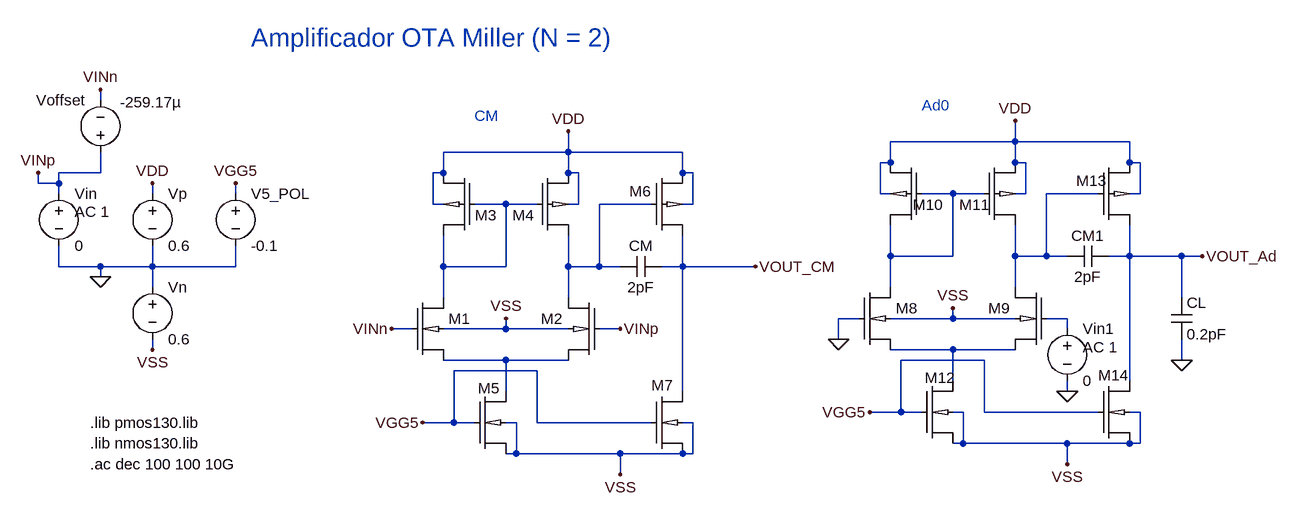
[diagram p0: schematic CMRR.asc]
CMRR.asc, the LTspice schematic file:
Version 4.1
SHEET 1 1760 680
WIRE -80 -352 -80 -368
WIRE 1328 -288 1328 -320
WIRE 1328 -288 1136 -288
WIRE 1504 -288 1328 -288
WIRE 640 -272 640 -304
WIRE 640 -272 448 -272
WIRE 816 -272 640 -272
WIRE 1136 -256 1136 -288
WIRE 1136 -256 1120 -256
WIRE 1328 -256 1328 -288
WIRE 1344 -256 1328 -256
WIRE 1504 -256 1504 -288
WIRE 1520 -256 1504 -256
WIRE -80 -240 -80 -272
WIRE -80 -240 -144 -240
WIRE 448 -240 448 -272
WIRE 448 -240 432 -240
WIRE 640 -240 640 -272
WIRE 656 -240 640 -240
WIRE 816 -240 816 -272
WIRE 832 -240 816 -240
WIRE -176 -224 -176 -240
WIRE -144 -224 -144 -240
WIRE -144 -224 -176 -224
WIRE -144 -208 -144 -224
WIRE 0 -208 0 -224
WIRE 128 -208 128 -224
WIRE 1120 -208 1120 -256
WIRE 1136 -208 1120 -208
WIRE 1232 -208 1184 -208
WIRE 1280 -208 1232 -208
WIRE 1344 -208 1344 -256
WIRE 1344 -208 1328 -208
WIRE 1456 -208 1376 -208
WIRE 1520 -208 1520 -256
WIRE 1520 -208 1504 -208
WIRE 432 -192 432 -240
WIRE 448 -192 432 -192
WIRE 544 -192 496 -192
WIRE 592 -192 544 -192
WIRE 656 -192 656 -240
WIRE 656 -192 640 -192
WIRE 768 -192 688 -192
WIRE 832 -192 832 -240
WIRE 832 -192 816 -192
WIRE 1136 -112 1136 -160
WIRE 1232 -112 1232 -208
WIRE 1232 -112 1136 -112
WIRE 1328 -112 1328 -160
WIRE 1376 -112 1376 -208
WIRE 1376 -112 1328 -112
WIRE 1408 -112 1376 -112
WIRE 1504 -112 1504 -160
WIRE 1504 -112 1472 -112
WIRE 1584 -112 1504 -112
WIRE 1616 -112 1584 -112
WIRE -144 -96 -144 -128
WIRE -80 -96 -144 -96
WIRE 0 -96 0 -128
WIRE 0 -96 -80 -96
WIRE 128 -96 128 -128
WIRE 128 -96 0 -96
WIRE 448 -96 448 -144
WIRE 544 -96 544 -192
WIRE 544 -96 448 -96
WIRE 640 -96 640 -144
WIRE 688 -96 688 -192
WIRE 688 -96 640 -96
WIRE 720 -96 688 -96
WIRE 816 -96 816 -144
WIRE 816 -96 784 -96
WIRE 928 -96 816 -96
WIRE -80 -80 -80 -96
WIRE 0 -64 0 -96
WIRE 1136 -64 1136 -112
WIRE 1328 -64 1328 -112
WIRE 448 -48 448 -96
WIRE 640 -48 640 -96
WIRE 1584 -48 1584 -112
WIRE 1088 -16 1056 -16
WIRE 1232 -16 1232 -32
WIRE 1232 -16 1136 -16
WIRE 1328 -16 1232 -16
WIRE 1408 -16 1376 -16
WIRE 400 0 368 0
WIRE 544 0 544 -16
WIRE 544 0 448 0
WIRE 640 0 544 0
WIRE 720 0 688 0
WIRE 1408 0 1408 -16
WIRE 1056 16 1056 -16
WIRE 0 32 0 16
WIRE 1232 32 1136 32
WIRE 1328 32 1232 32
WIRE 544 48 448 48
WIRE 640 48 544 48
WIRE 1280 48 1152 48
WIRE 1584 48 1584 16
WIRE 592 64 464 64
WIRE 1232 80 1232 32
WIRE 1504 80 1504 -112
WIRE 544 96 544 48
WIRE 816 96 816 -96
WIRE 1408 96 1408 80
WIRE 1152 128 1152 48
WIRE 1152 128 1104 128
WIRE 1184 128 1152 128
WIRE 1248 128 1232 128
WIRE 1280 128 1280 48
WIRE 1456 128 1280 128
WIRE 1520 128 1504 128
WIRE 464 144 464 64
WIRE 464 144 416 144
WIRE 496 144 464 144
WIRE 560 144 544 144
WIRE 592 144 592 64
WIRE 768 144 592 144
WIRE 832 144 816 144
WIRE 1248 176 1248 128
WIRE 1248 176 1232 176
WIRE 1408 176 1248 176
WIRE 1504 176 1408 176
WIRE 1520 176 1520 128
WIRE 1520 176 1504 176
WIRE 560 192 560 144
WIRE 560 192 544 192
WIRE 720 192 560 192
WIRE 816 192 720 192
WIRE 832 192 832 144
WIRE 832 192 816 192
WIRE 1408 208 1408 176
WIRE 720 224 720 192
FLAG -80 -80 0
FLAG 0 32 VSS
FLAG 0 -224 VDD
FLAG 640 -304 VDD
FLAG 720 224 VSS
FLAG 928 -96 VOUT_CM
FLAG 720 0 VINp
FLAG 368 0 VINn
FLAG 416 144 VGG5
FLAG 128 -224 VGG5
FLAG 544 -16 VSS
FLAG -80 -368 VINn
FLAG -176 -240 VINp
FLAG 1328 -320 VDD
FLAG 1408 208 VSS
FLAG 1616 -112 VOUT_Ad
FLAG 1104 128 VGG5
FLAG 1232 -32 VSS
FLAG 1408 96 0
FLAG 1056 16 0
FLAG 1584 48 0
SYMBOL voltage 0 -224 R0
WINDOW 123 0 0 Left 0
WINDOW 39 0 0 Left 0
SYMATTR InstName Vp
SYMATTR Value 0.6
SYMBOL voltage 0 -80 R0
WINDOW 123 0 0 Left 0
WINDOW 39 0 0 Left 0
SYMATTR InstName Vn
SYMATTR Value 0.6
SYMBOL nmos130 400 -48 R0
WINDOW 3 56 72 Invisible 2
SYMATTR InstName M1
SYMATTR SpiceLine width=10u length=2u
SYMBOL nmos130 688 -48 M0
WINDOW 3 56 72 Invisible 2
SYMATTR InstName M2
SYMATTR SpiceLine width=10u length=2u
SYMBOL pmos130 496 -144 R180
WINDOW 0 -34 31 Left 2
WINDOW 3 56 72 Invisible 2
SYMATTR InstName M3
SYMATTR SpiceLine width=20u length=2u
SYMBOL pmos130 592 -144 M180
WINDOW 0 -38 31 Left 2
WINDOW 3 56 72 Invisible 2
SYMATTR InstName M4
SYMATTR SpiceLine width=20u length=2u
SYMBOL nmos130 496 96 R0
WINDOW 0 5 -5 Left 2
WINDOW 3 56 72 Invisible 2
SYMATTR InstName M5
SYMATTR SpiceLine width=1u length=1u
SYMBOL pmos130 768 -144 M180
WINDOW 0 -34 68 Left 2
WINDOW 3 56 72 Invisible 2
SYMATTR InstName M6
SYMATTR SpiceLine width=80u length=500n
SYMBOL nmos130 768 96 R0
WINDOW 0 0 -9 Left 2
WINDOW 3 56 72 Invisible 2
SYMATTR InstName M7
SYMATTR SpiceLine width=40u length=20u
SYMBOL cap 784 -112 R90
WINDOW 0 0 32 VBottom 2
WINDOW 3 32 32 VTop 2
SYMATTR InstName CM
SYMATTR Value 2pF
SYMBOL voltage 128 -224 R0
WINDOW 123 0 0 Left 0
WINDOW 39 0 0 Left 0
SYMATTR InstName V5_POL
SYMATTR Value -0.1
SYMBOL voltage -144 -224 R0
WINDOW 123 24 44 Left 2
WINDOW 39 0 0 Left 0
SYMATTR InstName Vin
SYMATTR Value 0
SYMATTR Value2 AC 1
SYMBOL voltage -80 -256 R180
WINDOW 0 24 96 Left 2
WINDOW 3 -126 93 Left 2
WINDOW 123 0 0 Left 0
WINDOW 39 0 0 Left 0
SYMATTR InstName Voffset
SYMATTR Value -259.17µ
SYMBOL nmos130 1088 -64 R0
WINDOW 3 56 72 Invisible 2
SYMATTR InstName M8
SYMATTR SpiceLine width=10u length=2u
SYMBOL nmos130 1376 -64 M0
WINDOW 3 56 72 Invisible 2
SYMATTR InstName M9
SYMATTR SpiceLine width=10u length=2u
SYMBOL pmos130 1184 -160 R180
WINDOW 0 -34 31 Left 2
WINDOW 3 56 72 Invisible 2
SYMATTR InstName M10
SYMATTR SpiceLine width=20u length=2u
SYMBOL pmos130 1280 -160 M180
WINDOW 0 -38 31 Left 2
WINDOW 3 56 72 Invisible 2
SYMATTR InstName M11
SYMATTR SpiceLine width=20u length=2u
SYMBOL nmos130 1184 80 R0
WINDOW 0 5 -5 Left 2
WINDOW 3 56 72 Invisible 2
SYMATTR InstName M12
SYMATTR SpiceLine width=1u length=1u
SYMBOL pmos130 1456 -160 M180
WINDOW 0 -34 68 Left 2
WINDOW 3 56 72 Invisible 2
SYMATTR InstName M13
SYMATTR SpiceLine width=80u length=500n
SYMBOL nmos130 1456 80 R0
WINDOW 0 0 -9 Left 2
WINDOW 3 56 72 Invisible 2
SYMATTR InstName M14
SYMATTR SpiceLine width=40u length=20u
SYMBOL cap 1472 -128 R90
WINDOW 0 0 32 VBottom 2
WINDOW 3 32 32 VTop 2
SYMATTR InstName CM1
SYMATTR Value 2pF
SYMBOL voltage 1408 -16 R0
WINDOW 123 24 44 Left 2
WINDOW 39 0 0 Left 0
SYMATTR InstName Vin1
SYMATTR Value 0
SYMATTR Value2 AC 1
SYMBOL cap 1568 -48 R0
SYMATTR InstName CL
SYMATTR Value 0.2pF
TEXT -96 144 Left 2 !.lib pmos130.lib
TEXT -96 176 Left 2 !.lib nmos130.lib
TEXT 152 -448 Left 4 ;Amplificador OTA Miller (N = 2)
TEXT -96 208 Left 2 !.ac dec 100 100 10G
TEXT 496 -328 Left 2 ;CM
TEXT 1184 -344 Left 2 ;Ad0

The netlist it stands for:
* CMRR.asc
Vp VDD 0 0.6
Vn 0 VSS 0.6
X§M1 N003 VINn N007 VSS nmos130 width=10u length=2u  ; pins D G S B
X§M2 N004 VINp N007 VSS nmos130 width=10u length=2u  ; pins D G S B
X§M3 N003 N003 VDD VDD pmos130 width=20u length=2u  ; pins D G S B
X§M4 N004 N003 VDD VDD pmos130 width=20u length=2u  ; pins D G S B
X§M5 N007 VGG5 VSS VSS nmos130 width=1u length=1u  ; pins D G S B
X§M6 VOUT_CM N004 VDD VDD pmos130 width=80u length=500n  ; pins D G S B
X§M7 VOUT_CM VGG5 VSS VSS nmos130 width=40u length=20u  ; pins D G S B
CM VOUT_CM N004 2pF
V5_POL VGG5 0 -0.1
Vin VINp 0 0 AC 1
Voffset VINp VINn -259.17µ
X§M8 N001 0 N006 VSS nmos130 width=10u length=2u  ; pins D G S B
X§M9 N002 N005 N006 VSS nmos130 width=10u length=2u  ; pins D G S B
X§M10 N001 N001 VDD VDD pmos130 width=20u length=2u  ; pins D G S B
X§M11 N002 N001 VDD VDD pmos130 width=20u length=2u  ; pins D G S B
X§M12 N006 VGG5 VSS VSS nmos130 width=1u length=1u  ; pins D G S B
X§M13 VOUT_Ad N002 VDD VDD pmos130 width=80u length=500n  ; pins D G S B
X§M14 VOUT_Ad VGG5 VSS VSS nmos130 width=40u length=20u  ; pins D G S B
CM1 VOUT_Ad N002 2pF
Vin1 N005 0 0 AC 1
CL VOUT_Ad 0 0.2pF
.lib pmos130.lib
.lib nmos130.lib
* Amplificador OTA Miller (N = 2)
.ac dec 100 100 10G
* CM
* Ad0
.backanno
.end